# Altium schematic sheet FlexEMG_v0r0_SF2_DDR.SchDoc
size A3
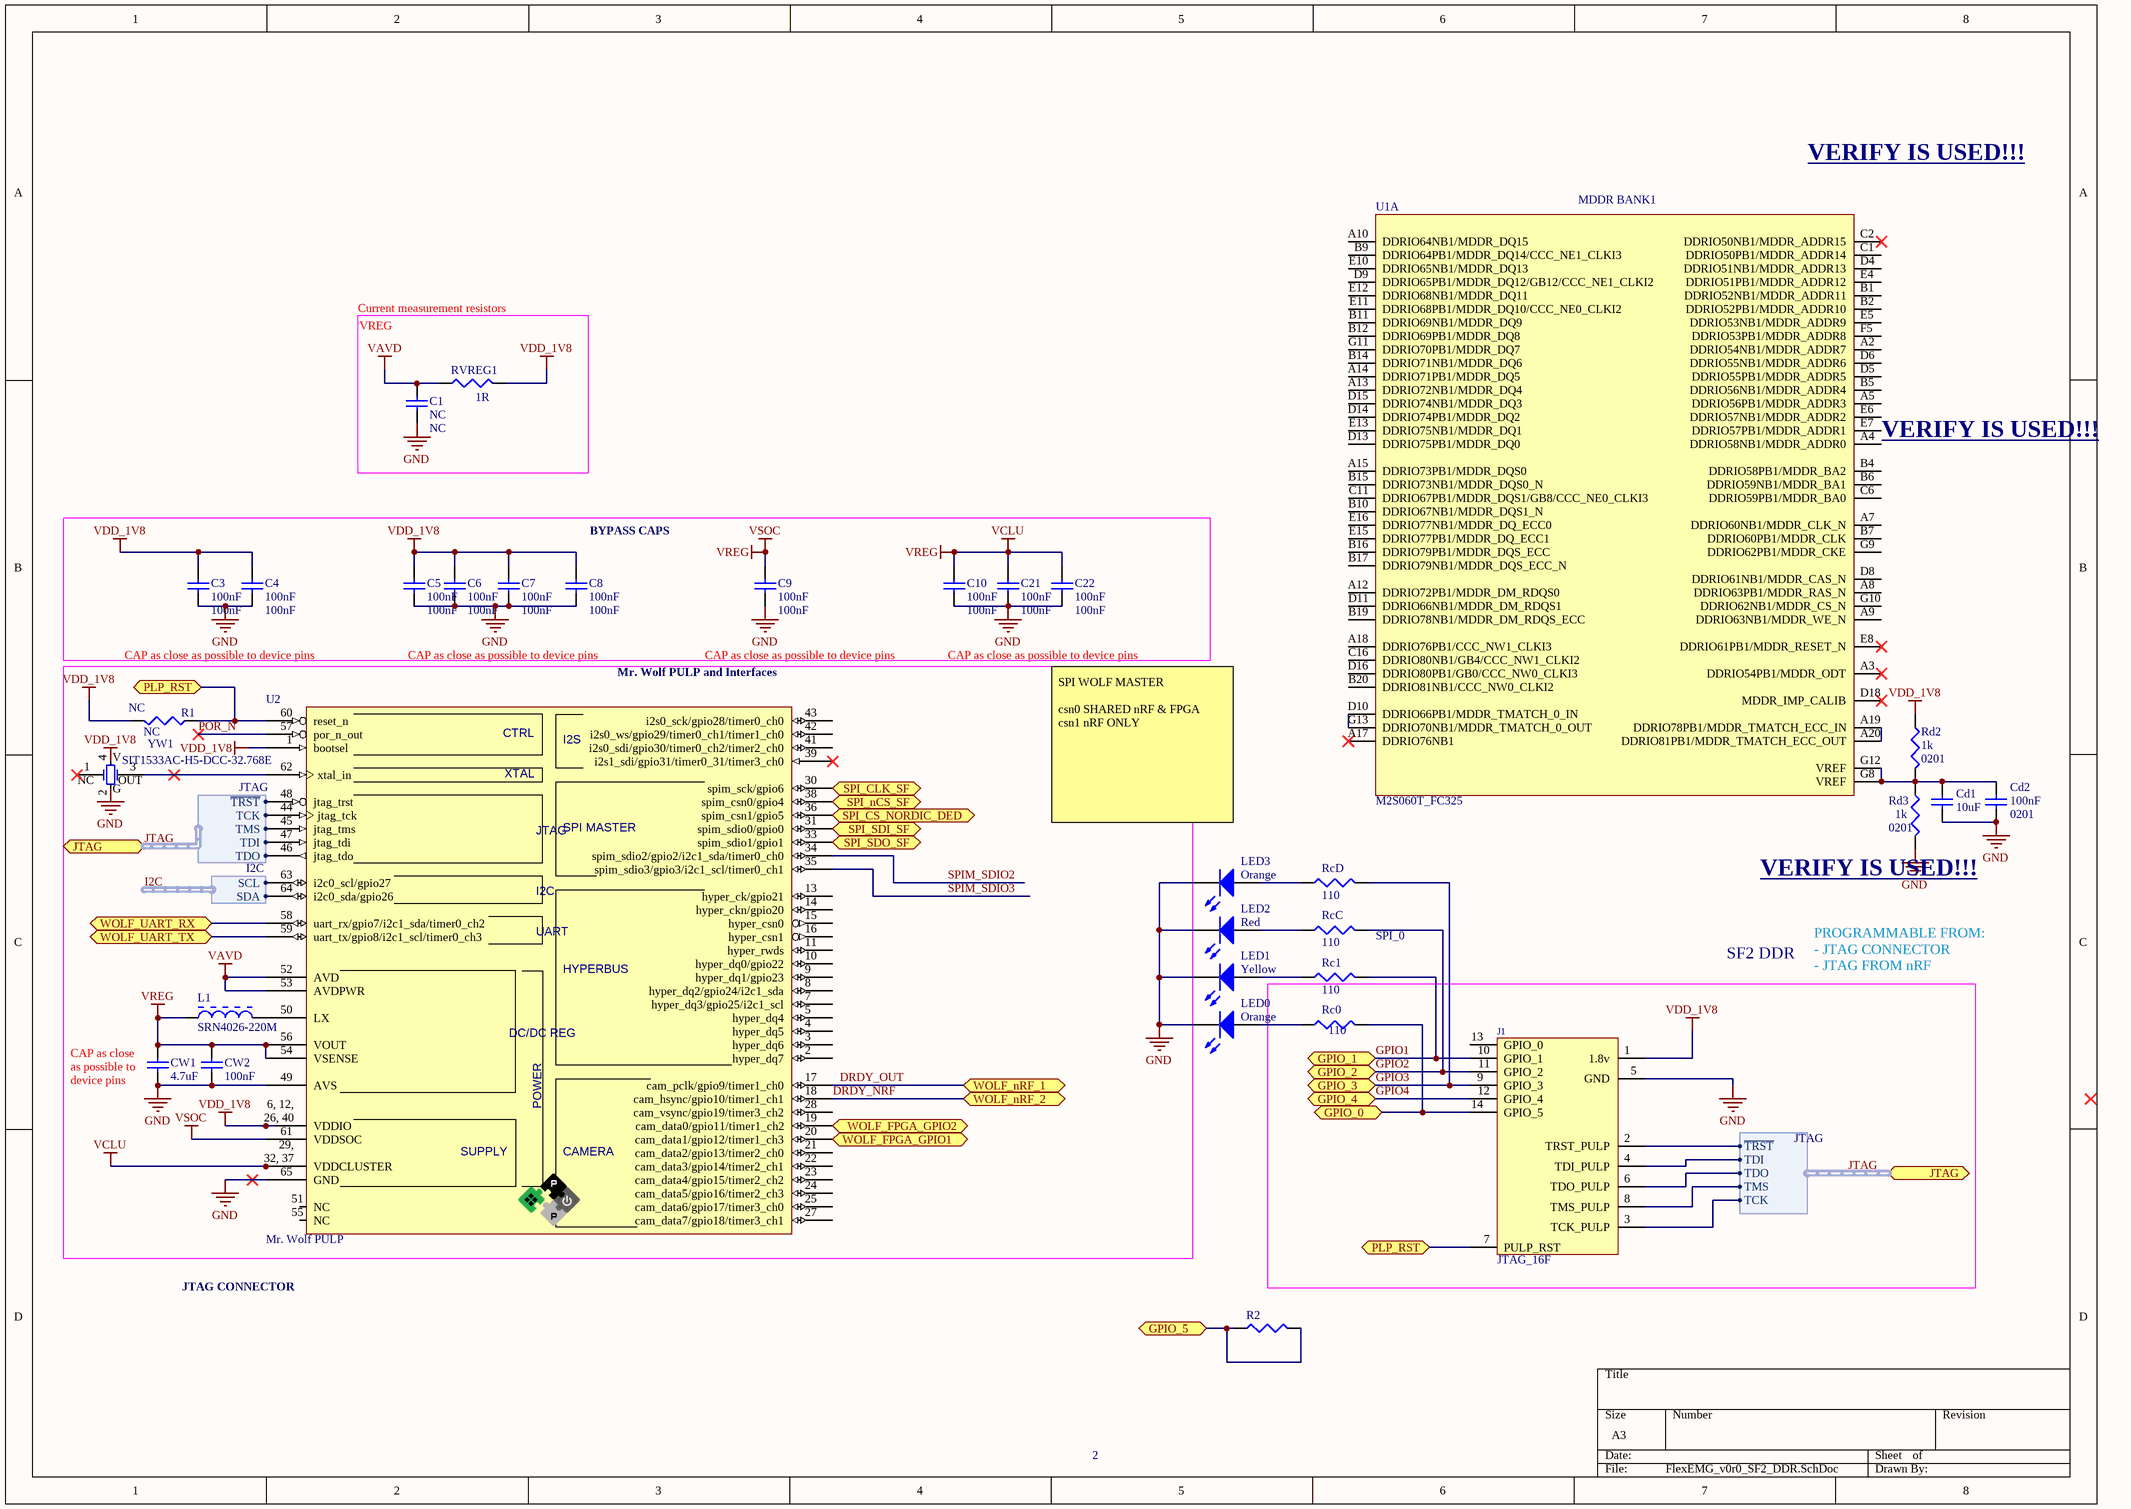
[diagram p0: FlexEMG_v0r0_SF2_DDR.SchDoc]

## Parts
C1  NC  [J1-0603]
C3  100nF  [0402]
C4  100nF  [0402_ss]
C5  100nF  [0402]
C6  100nF  [0402]
C7  100nF  [0402]
C8  100nF  [0402]
C9  100nF  [0402]
C10  100nF  [0402]
C21  100nF  [0402]
C22  100nF  [0402]
Cd1  value 10uF  [c0603-Murata-GR]  (hidden comment: GRM188R61E106MA73D)
Cd2  value 100nF  Package: 0201  [c0201-Murata-GR]  (hidden comment: GRM033R6YA104KE14D)
CW1  4.7uF  [0402]
CW2  100nF  [0402]
J1  JTAG_16F  [CONN_16-CLP]
L1  SRN4026-220M  [BOUR-IND-SRN4026]
LED0  Color: Orange  [LED-0603]
LED1  Color: Yellow  [LED-0603]
LED2  Color: Red  [LED-0603]
LED3  Color: Orange  [LED-0603]
R1  NC  [0402]
R2  (no value)  [0603]
Rc0  value 110  [0201_p]  (hidden comment: ERJ-2RKF1100X)
Rc1  value 110  [0201_p]  (hidden comment: ERJ-2RKF1100X)
RcC  value 110  [0201_p]  (hidden comment: ERJ-2RKF1100X)
RcD  value 110  [0201_p]  (hidden comment: ERJ-2RKF1100X)
Rd2  value 1k  Package: 0201  [0201_p]  (hidden comment: ERJ-1GEF1001C)
Rd3  value 1k  Package: 0201  [0201_p]  (hidden comment: ERJ-1GEF1001C)
RVREG1  value 1R  [J1-0603]
U1  M2S060T_FC325  [MCSM-CS-325]  (part A of 9)
U2  Mr. Wolf PULP  [QFN50P900X900X100_HS_NOVIAS_65M]
YW1  SIT1533AC-H5-DCC-32.768E  [SiT1533-C]

## Blocks framed on the sheet
BYPASS CAPS: C3-C10 C21 C22
Mr. Wolf PULP and Interfaces: CW1 CW2 L1 R1 U2 YW1

## Ports
GPIO_0, GPIO_1, GPIO_2, GPIO_3, GPIO_4, GPIO_5, JTAG (harness JTAG), PLP_RST (bidir), SPI_CLK_SF (bidir), SPI_CS_NORDIC_DED (bidir), SPI_nCS_SF (bidir), SPI_SDI_SF (bidir), SPI_SDO_SF (bidir), WOLF_FPGA_GPIO1 (bidir), WOLF_FPGA_GPIO2 (bidir), WOLF_nRF_1 (bidir), WOLF_nRF_2 (bidir), WOLF_UART_RX (bidir), WOLF_UART_TX (bidir)

## Harnesses
JTAG: ~{TRST}, TCK, TMS, TDI, TDO
I2C: SCL, SDA

## Nets
GND: C1.1 C3.1 C4.1 C5.1 C6.1 C7.1 C8.1 C9.1 C10.1 C21.1 C22.1 Cd1.1 Cd2.1 CW1.1 CW2.1 J1.5(GND) LED0.2(K) LED1.2(K) LED2.2(K) LED3.2(K) Rd3.2 U2.49(AVS) U2.65(GND) YW1.2(GND)
VAVD: C1.2 RVREG1.1 U2.52(AVD) U2.53(AVDPWR)
VCLU: C9.2 C10.2 C21.2 C22.2 CW1.2 CW2.2 L1.1 U2.29(VDDCLUSTER) U2.32(VDDCLUSTER) U2.37(VDDCLUSTER) U2.54(VSENSE) U2.56(VOUT) U2.61(VDDSOC)  [also labelled VREG, VSOC]
VDD_1V8: C3.2 C4.2 C5.2 C6.2 C7.2 C8.2 J1.1(1.8v) R1.2 Rd2.1 RVREG1.2 U2.1(bootsel) U2.6(VDDIO) U2.12(VDDIO) U2.26(VDDIO) U2.40(VDDIO) YW1.4(VDD)
DRDY_NRF: U2.18(cam_hsync/gpio10/timer1_ch1) ; port WOLF_nRF_2
DRDY_OUT: U2.17(cam_pclk/gpio9/timer1_ch0) ; port WOLF_nRF_1
GPIO1: J1.10(GPIO_1) Rc1.2 ; port GPIO_1
GPIO2: J1.11(GPIO_2) RcC.2 ; port GPIO_2
GPIO3: J1.9(GPIO_3) RcD.2 ; port GPIO_3
GPIO4: J1.12(GPIO_4) ; port GPIO_4
GPIO_0: J1.14(GPIO_5) Rc0.2 ; port GPIO_0
GPIO_5: R2.1 R2.2 ; port GPIO_5
I2C.SCL: U2.63(i2c0_scl/gpio27) ; harness I2C.SCL
I2C.SDA: U2.64(i2c0_sda/gpio26) ; harness I2C.SDA
JTAG.~{TRST}: J1.2(TRST_PULP) U2.48(jtag_trst) ; port JTAG.~{TRST}
JTAG.TCK: J1.3(TCK_PULP) U2.44(jtag_tck) ; port JTAG.TCK
JTAG.TDI: J1.4(TDI_PULP) U2.47(jtag_tdi) ; port JTAG.TDI
JTAG.TDO: J1.6(TDO_PULP) U2.46(jtag_tdo) ; port JTAG.TDO
JTAG.TMS: J1.8(TMS_PULP) U2.45(jtag_tms) ; port JTAG.TMS
PLP_RST: J1.7(PULP_RST) R1.1 U2.60(reset_n) ; port PLP_RST
POR_N: U2.57(por_n_out)
SPI_CLK_SF: U2.30(spim_sck/gpio6) ; port SPI_CLK_SF
SPI_CS_NORDIC_DED: U2.36(spim_csn1/gpio5) ; port SPI_CS_NORDIC_DED
SPI_nCS_SF: U2.38(spim_csn0/gpio4) ; port SPI_nCS_SF
SPI_SDI_SF: U2.31(spim_sdio0/gpio0) ; port SPI_SDI_SF
SPI_SDO_SF: U2.33(spim_sdio1/gpio1) ; port SPI_SDO_SF
SPIM_SDIO2: U2.34(spim_sdio2/gpio2/i2c1_sda/timer0_ch0)
SPIM_SDIO3: U2.35(spim_sdio3/gpio3/i2c1_scl/timer0_ch1)
WOLF_FPGA_GPIO1: U2.20(cam_data1/gpio12/timer1_ch3) ; port WOLF_FPGA_GPIO1
WOLF_FPGA_GPIO2: U2.19(cam_data0/gpio11/timer1_ch2) ; port WOLF_FPGA_GPIO2
WOLF_UART_RX: U2.58(uart_rx/gpio7/i2c1_sda/timer0_ch2) ; port WOLF_UART_RX
WOLF_UART_TX: U2.59(uart_tx/gpio8/i2c1_scl/timer0_ch3) ; port WOLF_UART_TX
NetCd1_2: Cd1.2 Cd2.2 Rd2.2 Rd3.1 U1.G8(VREF) U1.G12(VREF)
NetL1_2: L1.2 U2.50(LX)
NetLED0_1: LED0.1(A) Rc0.1
NetLED1_1: LED1.1(A) Rc1.1
NetLED2_1: LED2.1(A) RcC.1
NetLED3_1: LED3.1(A) RcD.1
NetU1_A19: U1.A19(DDRIO78PB1/MDDR_TMATCH_ECC_IN) U1.A20(DDRIO81PB1/MDDR_TMATCH_ECC_OUT)
NetU1_D10: U1.D10(DDRIO66PB1/MDDR_TMATCH_0_IN) U1.G13(DDRIO70NB1/MDDR_TMATCH_0_OUT)
NetU2_62: U2.62(xtal_in) YW1.3(OUT)

Not connected (* = marked no-connect by the designer): J1 13(GPIO_0); U1 A2(DDRIO54NB1/MDDR_ADDR7) A3(DDRIO54PB1/MDDR_ODT)* A4(DDRIO58NB1/MDDR_ADDR0) A5(DDRIO56PB1/MDDR_ADDR3) A7(DDRIO60NB1/MDDR_CLK_N) A8(DDRIO63PB1/MDDR_RAS_N) A9(DDRIO63NB1/MDDR_WE_N) A10(DDRIO64NB1/MDDR_DQ15) A12(DDRIO72PB1/MDDR_DM_RDQS0) A13(DDRIO72NB1/MDDR_DQ4) A14(DDRIO71PB1/MDDR_DQ5) A15(DDRIO73PB1/MDDR_DQS0) A17(DDRIO76NB1)* A18(DDRIO76PB1/CCC_NW1_CLKI3) B1(DDRIO52NB1/MDDR_ADDR11) B2(DDRIO52PB1/MDDR_ADDR10) B4(DDRIO58PB1/MDDR_BA2) B5(DDRIO56NB1/MDDR_ADDR4) B6(DDRIO59NB1/MDDR_BA1) B7(DDRIO60PB1/MDDR_CLK) B9(DDRIO64PB1/MDDR_DQ14/CCC_NE1_CLKI3) B10(DDRIO67NB1/MDDR_DQS1_N) B11(DDRIO69NB1/MDDR_DQ9) B12(DDRIO69PB1/MDDR_DQ8) B14(DDRIO71NB1/MDDR_DQ6) B15(DDRIO73NB1/MDDR_DQS0_N) B16(DDRIO79PB1/MDDR_DQS_ECC) B17(DDRIO79NB1/MDDR_DQS_ECC_N) B19(DDRIO78NB1/MDDR_DM_RDQS_ECC) B20(DDRIO81NB1/CCC_NW0_CLKI2) C1(DDRIO50PB1/MDDR_ADDR14) C2(DDRIO50NB1/MDDR_ADDR15)* C6(DDRIO59PB1/MDDR_BA0) C11(DDRIO67PB1/MDDR_DQS1/GB8/CCC_NE0_CLKI3) C16(DDRIO80NB1/GB4/CCC_NW1_CLKI2) D4(DDRIO51NB1/MDDR_ADDR13) D5(DDRIO55PB1/MDDR_ADDR5) D6(DDRIO55NB1/MDDR_ADDR6) D8(DDRIO61NB1/MDDR_CAS_N) D9(DDRIO65PB1/MDDR_DQ12/GB12/CCC_NE1_CLKI2) D11(DDRIO66NB1/MDDR_DM_RDQS1) D13(DDRIO75PB1/MDDR_DQ0) D14(DDRIO74PB1/MDDR_DQ2) D15(DDRIO74NB1/MDDR_DQ3) D16(DDRIO80PB1/GB0/CCC_NW0_CLKI3) D18(MDDR_IMP_CALIB)* E4(DDRIO51PB1/MDDR_ADDR12) E5(DDRIO53NB1/MDDR_ADDR9) E6(DDRIO57NB1/MDDR_ADDR2) E7(DDRIO57PB1/MDDR_ADDR1) E8(DDRIO61PB1/MDDR_RESET_N)* E10(DDRIO65NB1/MDDR_DQ13) E11(DDRIO68PB1/MDDR_DQ10/CCC_NE0_CLKI2) E12(DDRIO68NB1/MDDR_DQ11) E13(DDRIO75NB1/MDDR_DQ1) E15(DDRIO77PB1/MDDR_DQ_ECC1) E16(DDRIO77NB1/MDDR_DQ_ECC0) F5(DDRIO53PB1/MDDR_ADDR8) G9(DDRIO62PB1/MDDR_CKE) G10(DDRIO62NB1/MDDR_CS_N) G11(DDRIO70PB1/MDDR_DQ7); U2 2(hyper_dq7) 3(hyper_dq6) 4(hyper_dq5) 5(hyper_dq4) 7(hyper_dq3/gpio25/i2c1_scl) 8(hyper_dq2/gpio24/i2c1_sda) 9(hyper_dq1/gpio23) 10(hyper_dq0/gpio22) 11(hyper_rwds) 13(hyper_ck/gpio21) 14(hyper_ckn/gpio20) 15(hyper_csn0) 16(hyper_csn1) 21(cam_data2/gpio13/timer2_ch0) 22(cam_data3/gpio14/timer2_ch1) 23(cam_data4/gpio15/timer2_ch2) 24(cam_data5/gpio16/timer2_ch3) 25(cam_data6/gpio17/timer3_ch0) 27(cam_data7/gpio18/timer3_ch1) 28(cam_vsync/gpio19/timer3_ch2) 39(i2s1_sdi/gpio31/timer0_31/timer3_ch0)* 41(i2s0_sdi/gpio30/timer0_ch2/timer2_ch0) 42(i2s0_ws/gpio29/timer0_ch1/timer1_ch0) 43(i2s0_sck/gpio28/timer0_ch0) 51(NC) 55(NC); YW1 1(NC)*

## Buses and harness runs
harness JTAG = port JTAG

## Notes on the sheet
- VERIFY IS USED!!!
- (near U1) MDDR BANK1
- Current measurement resistors
- VREG
- (near U1) VERIFY IS USED!!!
- CAP as close as possible to device pins
- SPI WOLF MASTER
  csn0 SHARED nRF & FPGA
  csn1 nRF ONLY
- (near Rd3) VERIFY IS USED!!!
- (near RcC) SPI_0
- SF2 DDR
- PROGRAMMABLE FROM:
  - JTAG CONNECTOR
  - JTAG FROM nRF
- (near CW1) CAP as close as possible to device pins
- JTAG CONNECTOR
- 2
- (in symbol PULP_MR_WOLF) CTRL; I2S; XTAL; JTAG; SPI MASTER; I2C; UART; HYPERBUS; DC/DC REG; POWER; 6, 12,; 26, 40; 29,; SUPPLY; CAMERA; 32, 37
- (in symbol SIT-OSC32KHZ-SIT1533AC-H5-DCC-32.768) V; G

## Library data of the parts
C1 C3-C10 C21 C22 = Cap Semi: Capacitor (Semiconductor SIM Model); Published: 8-Jun-2000; LatestRevisionDate: 29-May-2009; LatestRevisionNote: IPC-7351 Footprint Added.; PackageReference: C1206; Publisher: Altium Limited; PackageDescription: Chip Capacitor
  C1: Value: NC
  C3-C10 C21 C22: Value: 100nF
Cd1 = Cap: CAP CER 10UF 25V X5R 0603 20%; Manufacturer: Murata; Supplier: Digikey; Supplier PN: 490-7202-1-ND; Manufacturer PN: GRM188R61E106MA73D
Cd2 = Cap: CAP CER 0.1UF 16V X7S 0201; Manufacturer: Murata; Note: 35V 10% X5R; Supplier PN: 490-10430-1-ND; Supplier: Digikey; Manufacturer PN: GRM033R6YA104KE14D
CW1 CW2 = Cap Semi: Capacitor (Semiconductor SIM Model); Value: 100pF; Published: 8-Jun-2000; LatestRevisionDate: 29-May-2009; LatestRevisionNote: IPC-7351 Footprint Added.; PackageReference: C1206; Publisher: Altium Limited; PackageDescription: Chip Capacitor
J1 = JTAG_16F: 12 pin female JTAG/SWD header for SmartFusion2 and Nordic; Manufacturer: Samtec; Manufacturer PN: CLP-105-02-x-D; Supplier: Digikey; Supplier PN: SAM1153-05-ND
L1 = BOUR-IND-SRN4026-220M: Semi-shielded Power Inductor, 22uH, 3A; Manufacturer: Bourns; Core Material: Ferrite; Tolerance: 20%; Current Rating: 670mA; DC Resistance (DCR): 234mR; Self Resonant Frequency: 16MHz; Test Frequency: 100kHz; ComponentLink1URL: https://www.bourns.com/docs/Product-Datasheets/SRN4026.pdf; ComponentLink1Description: Datasheet; Supplier 1: RSComponents; Supplier Part Number 1: 813-5643P; Manufacturer Part Number: SRN4026-220M; Stock 1: 2770; Pricing 1: 100=0.209, 500=0.176, 3000=0.135, 6000=0.132 (EUR); Mount: Surface Mount; Case/Package: Nonstandard; Weight: 0.004938oz; Min Operating Temperature: -40°C; Max Operating Temperature: 125°C; Packaging: Tape and Reel; Composition: Wirewound; Inductance: 22uh; Saturation Current: 670mA; Shielding: Shielded; Max DC Current: 670mA; Termination: SMD/SMT; RMS Current (Irms): 670mA; Inductance Tolerance: 20%; Package Quantity: 3000; Length: 4mm; Height: 2.5mm; Width: 4mm; Height - Seated (Max): 0.098inch; Depth: 4mm; REACH SVHC: No SVHC; ComponentLink2URL: https://datasheet.ciiva.com/48684/srn4026-48684665.pdf; ComponentLink2Description: https://datasheet.ciiva.com/48684/srn4026-48684665.pdf; ComponentLink3URL: https://datasheet.ciiva.com/46641/70371276-46641103.pdf; ComponentLink3Description: https://datasheet.ciiva.com/46641/70371276-46641103.pdf; Supplier 2: Farnell; Supplier Part Number 2: 2428221; Stock 2: 402; Pricing 2: 5=0.298, 50=0.217, 250=0.175, 500=0.16, 1500=0.155, 3000=0.151, 15000=0.146 (EUR); Supplier 3: Digi-Key; Supplier Part Number 3: SRN4026-220MTR-ND; Stock 3: 0; Pricing 3: 3000=0.144, 6000=0.1395, 15000=0.135, 30000=0.133 (USD); Supplier 4: Digi-Key; Supplier Part Number 4: SRN4026-220MDKR-ND; Stock 4: 863; Pricing 4: 1=0.41, 10=0.362, 100=0.2588, 500=0.2174, 1000=0.176 (USD); Supplier 5: Mouser; Supplier Part Number 5: 652-SRN4026-220M; Stock 5: 140; Pricing 5: 1=0.36, 10=0.246, 50=0.246, 100=0.224, 1000=0.152, 10000=0.122 (USD); Supplier 6: Digi-Key; Supplier Part Number 6: SRN4026-220MCT-ND; Stock 6: 863; Pricing 6: 1=0.41, 10=0.362, 100=0.2588, 500=0.2174, 1000=0.176 (USD); Supplier 7: RSComponents; Supplier Part Number 7: 8135643; Stock 7: 1990; Pricing 7: 10=0.227, 100=0.216, 500=0.19, 3000=0.13, 6000=0.12 (GBP); Supplier 8: Distrelec; Supplier Part Number 8: SRN4026-220M; Stock 8: 3000; Pricing 8: 1=0.6667, 10=0.5, 100=0.3333, 500=0.2857 (EUR); Supplier 9: Farnell; Supplier Part Number 9: 2428221RL; Stock 9: 930; Pricing 9: 50=0.209, 250=0.165, 500=0.15, 1500=0.122, 3000=0.117, 15000=0.106, 30000=0.104 (GBP); Supplier 10: Distrelec; Supplier Part Number 10: 30026188; Stock 10: 2895; Pricing 10: 1=0.214, 10=0.1299, 50=0.1266, 250=0.1203, 500=0.1173, 2500=0.1145 (EUR); Supplier 11: RSComponents; Supplier Part Number 11: 813-5643; Stock 11: 2000; Pricing 11: 10=0.227, 100=0.216 (GBP)
LED0 LED3 = LED: LED ORANGE CLEAR 0603 SMD; Manufacturer: Rohm; Manufacturer PN: SML-311DTT86; Supplier: Digikey; Supplier PN: 511-1303-1-ND
LED1 = LED: LED YELLOW CLEAR 0603 SMD; Manufacturer: Rohm; Manufacturer PN: SML-311YTT86; Supplier: Digikey; Supplier PN: 511-1305-1-ND
LED2 = LED: LED RED CLEAR 0603 SMD; Manufacturer: Rohm; Manufacturer PN: SML-311UTT86; Supplier: Digikey; Supplier PN: 511-1304-1-ND
R1 RVREG1 = Res3: Resistor; Published: 8-Jun-2000; LatestRevisionDate: 29-May-2009; LatestRevisionNote: IPC-7351 Footprint Added.; PackageReference: J1-0603; Publisher: Altium Limited; PackageDescription: Chip Resistor
  R1: Value: NC
R2 = Resistor: Supplier: Digikey; Manufacturer: *
Rc0 Rc1 RcC RcD = Resistor: RES SMD 110 OHM 1% 1/10W 0402; Manufacturer: Panasonic; Manufacturer PN: ERJ-2RKF1100X; Supplier: Digikey; Supplier P/N: P110LCT-ND; Power: 1/10W; Package: 0402
Rd2 Rd3 = Resistor: RES SMD 1K OHM 1% 1/20W 0201; Manufacturer: Panasonic; Manufacturer PN: ERJ-1GEF1001C; Supplier: Digikey; Supplier P/N: P1.00KABCT-ND; Power: 1/20W
U1 = M2S060T_FC325: SmartFusion2; Manufacturer PN: M2S060T-CS325; Manufacturer: Microsemi; Supplier: Future; Supplier PN: M2S060T-FCSG325I
U2 = PULP_MR_WOLF: Mr. Wolf PULP Heterogeneous Multi-Core System-On-Chip; Manufacturer: Aries Alectronics Inc.; Manufacturer Part Num: 23017; Part Class: Connectors; .checked_Footprint: 140604-11/scd; Num Pins: 64 (+9)
YW1 = SIT-OSC32KHZ-SIT1533AC-H5-DCC-32.768: 20 ppm, Ultra-Low Power 32.768 kHz Quartz XTAL Replacement; Current - Supply (max): 1.3uA; ComponentLink1URL: http://www.sitime.com/products/datasheets/sit1533/SiT1533-datasheet.pdf; ComponentLink1Description: Datasheet; Frequency: 32.768kHz; Supplier 1: Digi-Key; Supplier Part Number 1: 1473-1515-2-ND; Supplier 2: Digi-Key; Supplier Part Number 2: 1473-1515-1-ND; Supplier 3: Digi-Key; Supplier Part Number 3: 1473-1515-6-ND; Supplier 4: Digi-Key; Supplier Part Number 4: 1473-1516-2-ND; Supplier 5: Digi-Key; Supplier Part Number 5: 1473-1516-1-ND; Supplier 6: Digi-Key; Supplier Part Number 6: 1473-1516-6-ND; Supplier 7: Digi-Key; Supplier Part Number 7: SIT1533AC-H5-DCC-32.768S-ND; Supplier 8: Digi-Key; Supplier Part Number 8: SIT1533AC-H5-DCC-32.768D-ND